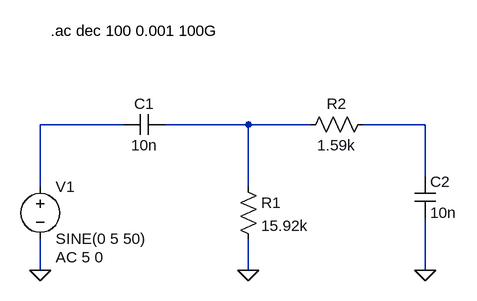
[diagram p0: schematic band pass.asc]
band pass.asc, the LTspice schematic file:
Version 4.1
SHEET 1 880 680
WIRE 256 16 128 16
WIRE 448 16 320 16
WIRE 544 16 448 16
WIRE 720 16 624 16
WIRE 720 96 720 16
WIRE 128 112 128 16
WIRE 448 112 448 16
WIRE 128 240 128 192
WIRE 448 240 448 192
WIRE 720 240 720 160
FLAG 448 240 0
FLAG 128 240 0
FLAG 720 240 0
SYMBOL voltage 128 96 R0
WINDOW 123 24 124 Left 2
WINDOW 39 0 0 Left 0
SYMATTR Value2 AC 5 0
SYMATTR InstName V1
SYMATTR Value SINE(0 5 50)
SYMBOL cap 320 0 R90
WINDOW 0 0 32 VBottom 2
WINDOW 3 32 32 VTop 2
SYMATTR InstName C1
SYMATTR Value 10n
SYMBOL res 432 96 R0
SYMATTR InstName R1
SYMATTR Value 15.92k
SYMBOL res 640 0 R90
WINDOW 0 0 56 VBottom 2
WINDOW 3 32 56 VTop 2
SYMATTR InstName R2
SYMATTR Value 1.59k
SYMBOL cap 704 96 R0
SYMATTR InstName C2
SYMATTR Value 10n
TEXT 144 -128 Left 2 !.ac dec 100 0.001 100G

The netlist it stands for:
* band pass.asc
V1 N001 0 SINE(0 5 50) AC 5 0
C1 N002 N001 10n
R1 N002 0 15.92k
R2 N003 N002 1.59k
C2 N003 0 10n
.ac dec 100 0.001 100G
.backanno
.end